# Altium project Glucometer-I.C.-Amp Test- V1.PrjPcb
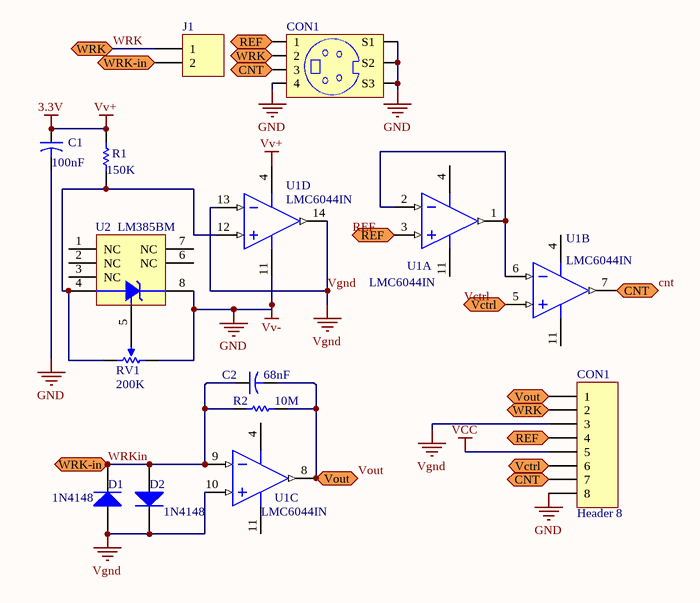
[diagram p0: Glucometer-I.C.-Amp Test- V1.SchDoc]
1 sheet, 12 parts. Net scope: flat (ports and power ports of the same name join across sheets).
Board file: Glucometer-I.C.-Amp Test- V1.PcbDoc

## Sheet Glucometer-I.C.-Amp Test- V1.SchDoc
size A4; PageSetup: Record=PageOptions|CenterHorizontal=True|CenterVertical=True|PrintScale=1.00|XCorrection=1.00|YCorrection=1.00|PrintKind=1|BorderSize=5000000|LeftOffset=0|BottomOffset=0|Orientation=1|PaperLength=1000|PaperWidth=1000|Scale=100|PaperSource=7|PrintQuality=-4|MediaType=1|DitherType=10|PaperKind=A4|PrintScaleMode=1

### Parts
(Parts that share a designator on the sheet are numbered #1, #2 ... from top to bottom, then left to right.)
C1  value 100nF  [CAPC1608N]  (hidden comment: Cap2)
C2  value 68nF  [CAPC1608N]  (hidden comment: Cap2)
CON1#1  (no value)  [CDIN2.6-3H4A]
CON1#2  Header 8  [HDR1X8]
D1  1N4148  [DO-35]
D2  1N4148  [DO-35]
J1  Header 2  [HDR1X2]  (value not drawn)
R1  value 150K  [RESC3216N]  (hidden comment: Res1)
R2  value 10M  [RESC3216N]  (hidden comment: Res1)
RV1  value 200K  [VR5]  (hidden comment: RPot)
U1  LMC6044IN  [M14A_N]  (parts A,B,C,D of 4)
U2  LM385BM  [M08A_N]

### Ports
CNT, REF, Vctrl, Vout, WRK, WRK-in

### Nets
3.3V: C1.1 R1.2 U1.4(V+)  [also labelled Vv+]
GND: C1.2 CON1#1.4 CON1#1.MH1(S1) CON1#1.MH2(S2) CON1#1.MH3(S3) CON1#2.8 RV1.1(TOP) U1.11(V-) U2.8(+V)  [also labelled Vv-]
VCC: CON1#2.5
Vgnd: CON1#2.3 D1.1(A) D2.2(K) U1.10(IN3+) U1.13(IN4-) U1.14(OUT4)
cnt: CON1#1.3 CON1#2.7 U1.7(OUT2) ; port CNT
REF: CON1#1.1 CON1#2.4 U1.3(IN1+) ; port REF
Vctrl: CON1#2.6 U1.5(IN2+) ; port Vctrl
Vout: C2.2 CON1#2.1 R2.1 U1.8(OUT3) ; port Vout
WRK: CON1#1.2 CON1#2.2 J1.1 ; port WRK
WRKin: C2.1 D1.2(K) D2.1(A) J1.2 R2.2 U1.9(IN3-) ; port WRK-in
NetR1_1: R1.1 RV1.2(BOT) U1.12(IN4+) U2.4(-V)
NetRV1_3: RV1.3(TAP) U2.5(FB)
NetU1_1: U1.1(OUT1) U1.2(IN1-) U1.6(IN2-)

Not connected (* = marked no-connect by the designer): U2 1(NC) 2(NC) 3(NC) 6(NC) 7(NC)

### Library data of the parts
C1 C2 = Cap2: Capacitor; Published: 23-Sep-2002; PackageReference: CAPR5-4X5; Publisher: Altium Limited; PackageDescription: Capacitor; 2 Leads
CON1#1 = MiniDin 4Pins - SuperVideo: MiniDin 4 Pins
CON1#2 = Header 8: Header, 8-Pin; LatestRevisionDate: 17-Jul-2002; LatestRevisionNote: Re-released for DXP Platform.; Publisher: Altium Limited
D1 D2 = 1N4148: High Conductance Fast Diode; Published: 8-Jun-2000; LatestRevisionDate: 17-Jul-2002; LatestRevisionNote: Re-released for DXP Platform.; DatasheetDocument: 1997; PackageReference: DO-35; Publisher: Altium Limited; Code_JEDEC: DO-204-AH; ComponentLink1Description: Manufacturer Link; ComponentLink1URL: http://www.fairchildsemi.com/; ComponentLink2Description: Datasheet; ComponentLink2URL: http://www.fairchildsemi.com/ds/1N%2F1N4148.pdf
J1 = Header 2: Header, 2-Pin; LatestRevisionDate: 17-Jul-2002; LatestRevisionNote: Re-released for DXP Platform.; Publisher: Altium Limited
R1 R2 = Res1: Resistor; Published: 8-Jun-2000; LatestRevisionDate: 17-Jul-2002; LatestRevisionNote: Re-released for DXP Platform.; PackageReference: AXIAL-0.3; Publisher: Altium Limited; PackageDescription: Axial Device, Thru-Hole; 2 Leads; 0.3 in Pin Spacing
RV1 = RPot: Potentiometer; pin to pad: 2>3 3>2; Sim Note: Enter the Resistance value and the set point into parameter fields.; Set Position: 0.5; Published: 8-Jun-2000; LatestRevisionDate: 17-Jul-2002; LatestRevisionNote: Re-released for DXP Platform.; PackageReference: VR5; Publisher: Altium Limited; PackageDescription: Variable Resistor, Thru-Hole; 3 Leads
U1 = LMC6044IN: CMOS Quad Micropower Operational Amplifier, 14-pin MDIP; Manufacturer: National Semiconductor; PackageTopMarking: NSUZXYYTTE#*LMC6044IN; PowerWise: Y; CompType: Amplifiers; Published: 4-Dec-2008; LatestRevisionDate: 13-Jan-2009; LatestRevisionNote: Sim Model Added.; DatasheetVersion: Aug-2000; PackageVersion: revG, May-2006; PackageReference: N14A; Publisher: Altium Limited; PackageDescription: MDIP, .750 x .250 x.130in, 14 Lead, .100in Pitch; Supplier 1: Farnell; Supplier Part Number 1: 9494634; PartNumber: LMC6044IN; RoHS: N; PinCount: 14; Code_JEDEC: MS-001-AA; ComponentLink1Description: LMC6044 Datasheet; ComponentLink1URL: http://www.national.com/ds/LM/LMC6044.pdf; ComponentLink2Description: LMC6044 Web Page; ComponentLink2URL: http://www.national.com/pf/LM/LMC6044.html; ComponentLink3Description: N14A Package Page; ComponentLink3URL: http://www.national.com/packaging/folders/n14a.html
U2 = LM385BM: Adjustable Micropower Voltage Reference, 8-pin Narrow SOIC; Manufacturer: National Semiconductor; PackageTopMarking: NSZXTT*LM385*BM; PowerWise: N; CompType: Voltage Reference IC; Published: 4-Dec-2008; DatasheetVersion: Jan-2008; PackageVersion: revM, May-2009; PackageReference: M08A; Publisher: Altium Limited; PackageDescription: SOIC Narrow, 4.9 x 3.9 x 1.45mm, 8 Lead, 1.27mm Pitch; Supplier 1: Farnell; Supplier Part Number 1: 953817; PartNumber: LM385BM; RoHS: N; PinCount: 8; Code_JEDEC: MS-012-AA; Code_IPC: SOIC127P600-8; ComponentLink1Description: LM385-ADJ Datasheet; ComponentLink1URL: http://www.national.com/ds/LM/LM385-ADJ.pdf; ComponentLink2Description: LM385-ADJ Web Page; ComponentLink2URL: http://www.national.com/pf/LM/LM385-ADJ.html; ComponentLink3Description: M08A Package Page; ComponentLink3URL: http://www.national.com/packaging/folders/m08a.html